# Altium schematic sheet epm_control_2.SchDoc
size A
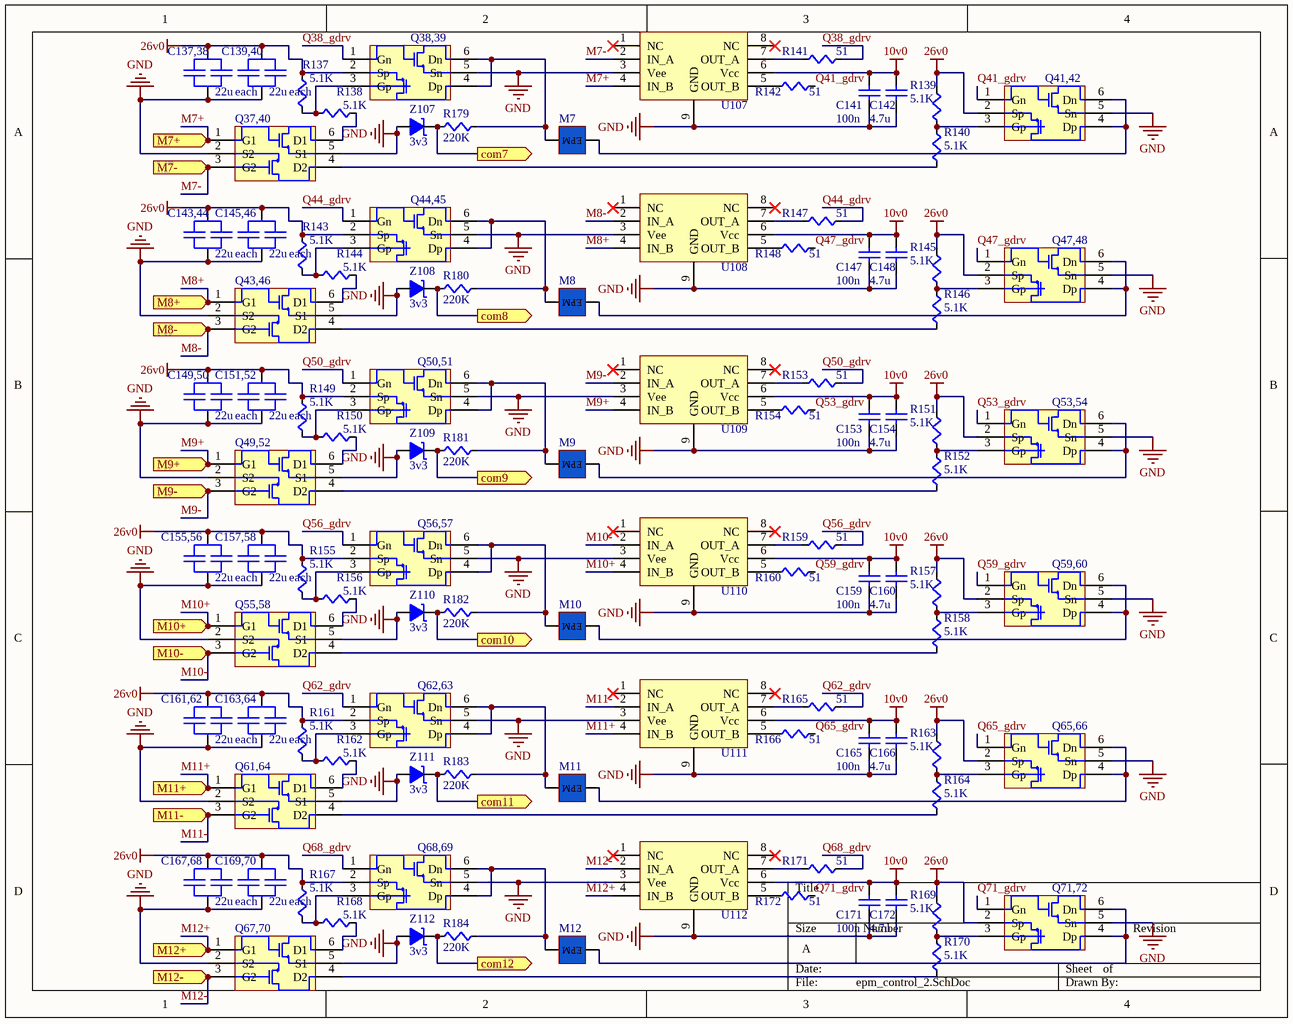
[diagram p0: epm_control_2.SchDoc]

## Parts
C137,38  value 22u  [dicap_smd_1206]  (hidden comment: Dicap)
C139,40  value 22u  [dicap_smd_1206]  (hidden comment: Dicap)
C141  value 100n  [SMD0603_cap]  (hidden comment: Cap)
C142  value 4.7u  [SMD0603_cap]  (hidden comment: Cap)
C143,44  value 22u  [dicap_smd_1206]  (hidden comment: Dicap)
C145,46  value 22u  [dicap_smd_1206]  (hidden comment: Dicap)
C147  value 100n  [SMD0603_cap]  (hidden comment: Cap)
C148  value 4.7u  [SMD0603_cap]  (hidden comment: Cap)
C149,50  value 22u  [dicap_smd_1206]  (hidden comment: Dicap)
C151,52  value 22u  [dicap_smd_1206]  (hidden comment: Dicap)
C153  value 100n  [SMD0603_cap]  (hidden comment: Cap)
C154  value 4.7u  [SMD0603_cap]  (hidden comment: Cap)
C155,56  value 22u  [dicap_smd_1206]  (hidden comment: Dicap)
C157,58  value 22u  [dicap_smd_1206]  (hidden comment: Dicap)
C159  value 100n  [SMD0603_cap]  (hidden comment: Cap)
C160  value 4.7u  [SMD0603_cap]  (hidden comment: Cap)
C161,62  value 22u  [dicap_smd_1206]  (hidden comment: Dicap)
C163,64  value 22u  [dicap_smd_1206]  (hidden comment: Dicap)
C165  value 100n  [SMD0603_cap]  (hidden comment: Cap)
C166  value 4.7u  [SMD0603_cap]  (hidden comment: Cap)
C167,68  value 22u  [dicap_smd_1206]  (hidden comment: Dicap)
C169,70  value 22u  [dicap_smd_1206]  (hidden comment: Dicap)
C171  value 100n  [SMD0603_cap]  (hidden comment: Cap)
C172  value 4.7u  [SMD0603_cap]  (hidden comment: Cap)
M7  EPM  [40awg_epm]  (value not drawn)
M8  EPM  [40awg_epm]  (value not drawn)
M9  EPM  [40awg_epm]  (value not drawn)
M10  EPM  [40awg_epm]  (value not drawn)
M11  EPM  [40awg_epm]  (value not drawn)
M12  EPM  [40awg_epm]  (value not drawn)
Q37,40  SI3292  [sot23-6l]  (value not drawn)
Q38,39  DMG6602  [sot23-6l]  (value not drawn)
Q41,42  DMG6602  [sot23-6l]  (value not drawn)
Q43,46  SI3292  [sot23-6l]  (value not drawn)
Q44,45  DMG6602  [sot23-6l]  (value not drawn)
Q47,48  DMG6602  [sot23-6l]  (value not drawn)
Q49,52  SI3292  [sot23-6l]  (value not drawn)
Q50,51  DMG6602  [sot23-6l]  (value not drawn)
Q53,54  DMG6602  [sot23-6l]  (value not drawn)
Q55,58  SI3292  [sot23-6l]  (value not drawn)
Q56,57  DMG6602  [sot23-6l]  (value not drawn)
Q59,60  DMG6602  [sot23-6l]  (value not drawn)
Q61,64  SI3292  [sot23-6l]  (value not drawn)
Q62,63  DMG6602  [sot23-6l]  (value not drawn)
Q65,66  DMG6602  [sot23-6l]  (value not drawn)
Q67,70  SI3292  [sot23-6l]  (value not drawn)
Q68,69  DMG6602  [sot23-6l]  (value not drawn)
Q71,72  DMG6602  [sot23-6l]  (value not drawn)
R137  value 5.1K  [SMD0603]  (hidden comment: Res)
R138  value 5.1K  [SMD0603]  (hidden comment: Res)
R139  value 5.1K  [SMD0603]  (hidden comment: Res)
R140  value 5.1K  [SMD0603]  (hidden comment: Res)
R141  value 51  [SMD0603]  (hidden comment: Res)
R142  value 51  [SMD0603]  (hidden comment: Res)
R143  value 5.1K  [SMD0603]  (hidden comment: Res)
R144  value 5.1K  [SMD0603]  (hidden comment: Res)
R145  value 5.1K  [SMD0603]  (hidden comment: Res)
R146  value 5.1K  [SMD0603]  (hidden comment: Res)
R147  value 51  [SMD0603]  (hidden comment: Res)
R148  value 51  [SMD0603]  (hidden comment: Res)
R149  value 5.1K  [SMD0603]  (hidden comment: Res)
R150  value 5.1K  [SMD0603]  (hidden comment: Res)
R151  value 5.1K  [SMD0603]  (hidden comment: Res)
R152  value 5.1K  [SMD0603]  (hidden comment: Res)
R153  value 51  [SMD0603]  (hidden comment: Res)
R154  value 51  [SMD0603]  (hidden comment: Res)
R155  value 5.1K  [SMD0603]  (hidden comment: Res)
R156  value 5.1K  [SMD0603]  (hidden comment: Res)
R157  value 5.1K  [SMD0603]  (hidden comment: Res)
R158  value 5.1K  [SMD0603]  (hidden comment: Res)
R159  value 51  [SMD0603]  (hidden comment: Res)
R160  value 51  [SMD0603]  (hidden comment: Res)
R161  value 5.1K  [SMD0603]  (hidden comment: Res)
R162  value 5.1K  [SMD0603]  (hidden comment: Res)
R163  value 5.1K  [SMD0603]  (hidden comment: Res)
R164  value 5.1K  [SMD0603]  (hidden comment: Res)
R165  value 51  [SMD0603]  (hidden comment: Res)
R166  value 51  [SMD0603]  (hidden comment: Res)
R167  value 5.1K  [SMD0603]  (hidden comment: Res)
R168  value 5.1K  [SMD0603]  (hidden comment: Res)
R169  value 5.1K  [SMD0603]  (hidden comment: Res)
R170  value 5.1K  [SMD0603]  (hidden comment: Res)
R171  value 51  [SMD0603]  (hidden comment: Res)
R172  value 51  [SMD0603]  (hidden comment: Res)
R179  value 220K  [SMD0603]  (hidden comment: Res)
R180  value 220K  [SMD0603]  (hidden comment: Res)
R181  value 220K  [SMD0603]  (hidden comment: Res)
R182  value 220K  [SMD0603]  (hidden comment: Res)
R183  value 220K  [SMD0603]  (hidden comment: Res)
R184  value 220K  [SMD0603]  (hidden comment: Res)
U107  LM5111-1  [tssop-8]  (value not drawn)
U108  LM5111-1  [tssop-8]  (value not drawn)
U109  LM5111-1  [tssop-8]  (value not drawn)
U110  LM5111-1  [tssop-8]  (value not drawn)
U111  LM5111-1  [tssop-8]  (value not drawn)
U112  LM5111-1  [tssop-8]  (value not drawn)
Z107  value 3v3  [SOD-323F]  (hidden comment: Zener)
Z108  value 3v3  [SOD-323F]  (hidden comment: Zener)
Z109  value 3v3  [SOD-323F]  (hidden comment: Zener)
Z110  value 3v3  [SOD-323F]  (hidden comment: Zener)
Z111  value 3v3  [SOD-323F]  (hidden comment: Zener)
Z112  value 3v3  [SOD-323F]  (hidden comment: Zener)

## Ports
com7 (out), com8 (out), com9 (out), com10 (out), com11 (out), com12 (out), M7+ (in), M7- (in), M8+ (in), M8- (in), M9+ (in), M9- (in), M10+ (in), M10- (in), M11+ (in), M11- (in), M12+ (in), M12- (in)

## Nets
10v0: C141.2 C142.2 C147.2 C148.2 C153.2 C154.2 C159.2 C160.2 C165.2 C166.2 C171.2 C172.2 U107.6(Vcc) U108.6(Vcc) U109.6(Vcc) U110.6(Vcc) U111.6(Vcc) U112.6(Vcc)
26v0: C137,38.2 C139,40.2 C143,44.2 C145,46.2 C149,50.2 C151,52.2 C155,56.2 C157,58.2 C161,62.2 C163,64.2 C167,68.2 C169,70.2 Q38,39.2(Sp) Q41,42.2(Sp) Q44,45.2(Sp) Q47,48.2(Sp) Q50,51.2(Sp) Q53,54.2(Sp) Q56,57.2(Sp) Q59,60.2(Sp) Q62,63.2(Sp) Q65,66.2(Sp) Q68,69.2(Sp) Q71,72.2(Sp) R137.2 R139.2 R143.2 R145.2 R149.2 R151.2 R155.2 R157.2 R161.2 R163.2 R167.2 R169.2
GND: C137,38.1 C139,40.1 C141.1 C142.1 C143,44.1 C145,46.1 C147.1 C148.1 C149,50.1 C151,52.1 C153.1 C154.1 C155,56.1 C157,58.1 C159.1 C160.1 C161,62.1 C163,64.1 C165.1 C166.1 C167,68.1 C169,70.1 C171.1 C172.1 Q37,40.2(S2) Q37,40.5(S1) Q38,39.5(Sn) Q41,42.5(Sn) Q43,46.2(S2) Q43,46.5(S1) Q44,45.5(Sn) Q47,48.5(Sn) Q49,52.2(S2) Q49,52.5(S1) Q50,51.5(Sn) Q53,54.5(Sn) Q55,58.2(S2) Q55,58.5(S1) Q56,57.5(Sn) Q59,60.5(Sn) Q61,64.2(S2) Q61,64.5(S1) Q62,63.5(Sn) Q65,66.5(Sn) Q67,70.2(S2) Q67,70.5(S1) Q68,69.5(Sn) Q71,72.5(Sn) U107.3(Vee) U107.9(GND) U108.3(Vee) U108.9(GND) U109.3(Vee) U109.9(GND) U110.3(Vee) U110.9(GND) U111.3(Vee) U111.9(GND) U112.3(Vee) U112.9(GND) Z107.A Z108.A Z109.A Z110.A Z111.A Z112.A
com7: R179.1 Z107.K ; port com7
com8: R180.1 Z108.K ; port com8
com9: R181.1 Z109.K ; port com9
com10: R182.1 Z110.K ; port com10
com11: R183.1 Z111.K ; port com11
com12: R184.1 Z112.K ; port com12
M7+: Q37,40.1(G1) U107.4(IN_B) ; port M7+
M7-: Q37,40.3(G2) U107.2(IN_A) ; port M7-
M8+: Q43,46.1(G1) U108.4(IN_B) ; port M8+
M8-: Q43,46.3(G2) U108.2(IN_A) ; port M8-
M9+: Q49,52.1(G1) U109.4(IN_B) ; port M9+
M9-: Q49,52.3(G2) U109.2(IN_A) ; port M9-
M10+: Q55,58.1(G1) U110.4(IN_B) ; port M10+
M10-: Q55,58.3(G2) U110.2(IN_A) ; port M10-
M11+: Q61,64.1(G1) U111.4(IN_B) ; port M11+
M11-: Q61,64.3(G2) U111.2(IN_A) ; port M11-
M12+: Q67,70.1(G1) U112.4(IN_B) ; port M12+
M12-: Q67,70.3(G2) U112.2(IN_A) ; port M12-
Q38_gdrv: Q38,39.1(Gn) R141.1
Q41_gdrv: Q41,42.1(Gn) R142.1
Q44_gdrv: Q44,45.1(Gn) R147.1
Q47_gdrv: Q47,48.1(Gn) R148.1
Q50_gdrv: Q50,51.1(Gn) R153.1
Q53_gdrv: Q53,54.1(Gn) R154.1
Q56_gdrv: Q56,57.1(Gn) R159.1
Q59_gdrv: Q59,60.1(Gn) R160.1
Q62_gdrv: Q62,63.1(Gn) R165.1
Q65_gdrv: Q65,66.1(Gn) R166.1
Q68_gdrv: Q68,69.1(Gn) R171.1
Q71_gdrv: Q71,72.1(Gn) R172.1
NetM7_1: M7.1 Q41,42.4(Dp) Q41,42.6(Dn)
NetM7_2: M7.2 Q38,39.4(Dp) Q38,39.6(Dn) R179.2
NetM8_1: M8.1 Q47,48.4(Dp) Q47,48.6(Dn)
NetM8_2: M8.2 Q44,45.4(Dp) Q44,45.6(Dn) R180.2
NetM9_1: M9.1 Q53,54.4(Dp) Q53,54.6(Dn)
NetM9_2: M9.2 Q50,51.4(Dp) Q50,51.6(Dn) R181.2
NetM10_1: M10.1 Q59,60.4(Dp) Q59,60.6(Dn)
NetM10_2: M10.2 Q56,57.4(Dp) Q56,57.6(Dn) R182.2
NetM11_1: M11.1 Q65,66.4(Dp) Q65,66.6(Dn)
NetM11_2: M11.2 Q62,63.4(Dp) Q62,63.6(Dn) R183.2
NetM12_1: M12.1 Q71,72.4(Dp) Q71,72.6(Dn)
NetM12_2: M12.2 Q68,69.4(Dp) Q68,69.6(Dn) R184.2
NetQ37,40_4: Q37,40.4(D2) R140.1
NetQ37,40_6: Q37,40.6(D1) R138.1
NetQ38,39_3: Q38,39.3(Gp) R137.1 R138.2
NetQ41,42_3: Q41,42.3(Gp) R139.1 R140.2
NetQ43,46_4: Q43,46.4(D2) R146.1
NetQ43,46_6: Q43,46.6(D1) R144.1
NetQ44,45_3: Q44,45.3(Gp) R143.1 R144.2
NetQ47,48_3: Q47,48.3(Gp) R145.1 R146.2
NetQ49,52_4: Q49,52.4(D2) R152.1
NetQ49,52_6: Q49,52.6(D1) R150.1
NetQ50,51_3: Q50,51.3(Gp) R149.1 R150.2
NetQ53,54_3: Q53,54.3(Gp) R151.1 R152.2
NetQ55,58_4: Q55,58.4(D2) R158.1
NetQ55,58_6: Q55,58.6(D1) R156.1
NetQ56,57_3: Q56,57.3(Gp) R155.1 R156.2
NetQ59,60_3: Q59,60.3(Gp) R157.1 R158.2
NetQ61,64_4: Q61,64.4(D2) R164.1
NetQ61,64_6: Q61,64.6(D1) R162.1
NetQ62,63_3: Q62,63.3(Gp) R161.1 R162.2
NetQ65,66_3: Q65,66.3(Gp) R163.1 R164.2
NetQ67,70_4: Q67,70.4(D2) R170.1
NetQ67,70_6: Q67,70.6(D1) R168.1
NetQ68,69_3: Q68,69.3(Gp) R167.1 R168.2
NetQ71,72_3: Q71,72.3(Gp) R169.1 R170.2
NetR141_2: R141.2 U107.7(OUT_A)
NetR142_2: R142.2 U107.5(OUT_B)
NetR147_2: R147.2 U108.7(OUT_A)
NetR148_2: R148.2 U108.5(OUT_B)
NetR153_2: R153.2 U109.7(OUT_A)
NetR154_2: R154.2 U109.5(OUT_B)
NetR159_2: R159.2 U110.7(OUT_A)
NetR160_2: R160.2 U110.5(OUT_B)
NetR165_2: R165.2 U111.7(OUT_A)
NetR166_2: R166.2 U111.5(OUT_B)
NetR171_2: R171.2 U112.7(OUT_A)
NetR172_2: R172.2 U112.5(OUT_B)

Not connected (* = marked no-connect by the designer): U107 1(NC)* 8(NC)*; U108 1(NC)* 8(NC)*; U109 1(NC)* 8(NC)*; U110 1(NC)* 8(NC)*; U111 1(NC)* 8(NC)*; U112 1(NC)* 8(NC)*

## Notes on the sheet
- (in symbol Dicap) each

## Library data of the parts
C141 C142 C147 C148 C153 C154 C159 C160 C165 C166 C171 C172 = Capacitor Ceramic: Ceramic Chip Capacitor
R137-R172 R179-R184 = Resistor